# Altium schematic sheet 11_LMS1_Power.SchDoc: LMS7002M power supply (LMS1)
size A3; Organization: Lime Microsystems; Address1: Surrey Tech Centre; Address2: Guildford GU2 7YG; Address3: Surrey; Address4: United Kingdom; Revision: v1.1; SheetNumber: 10; SheetTotal: 31
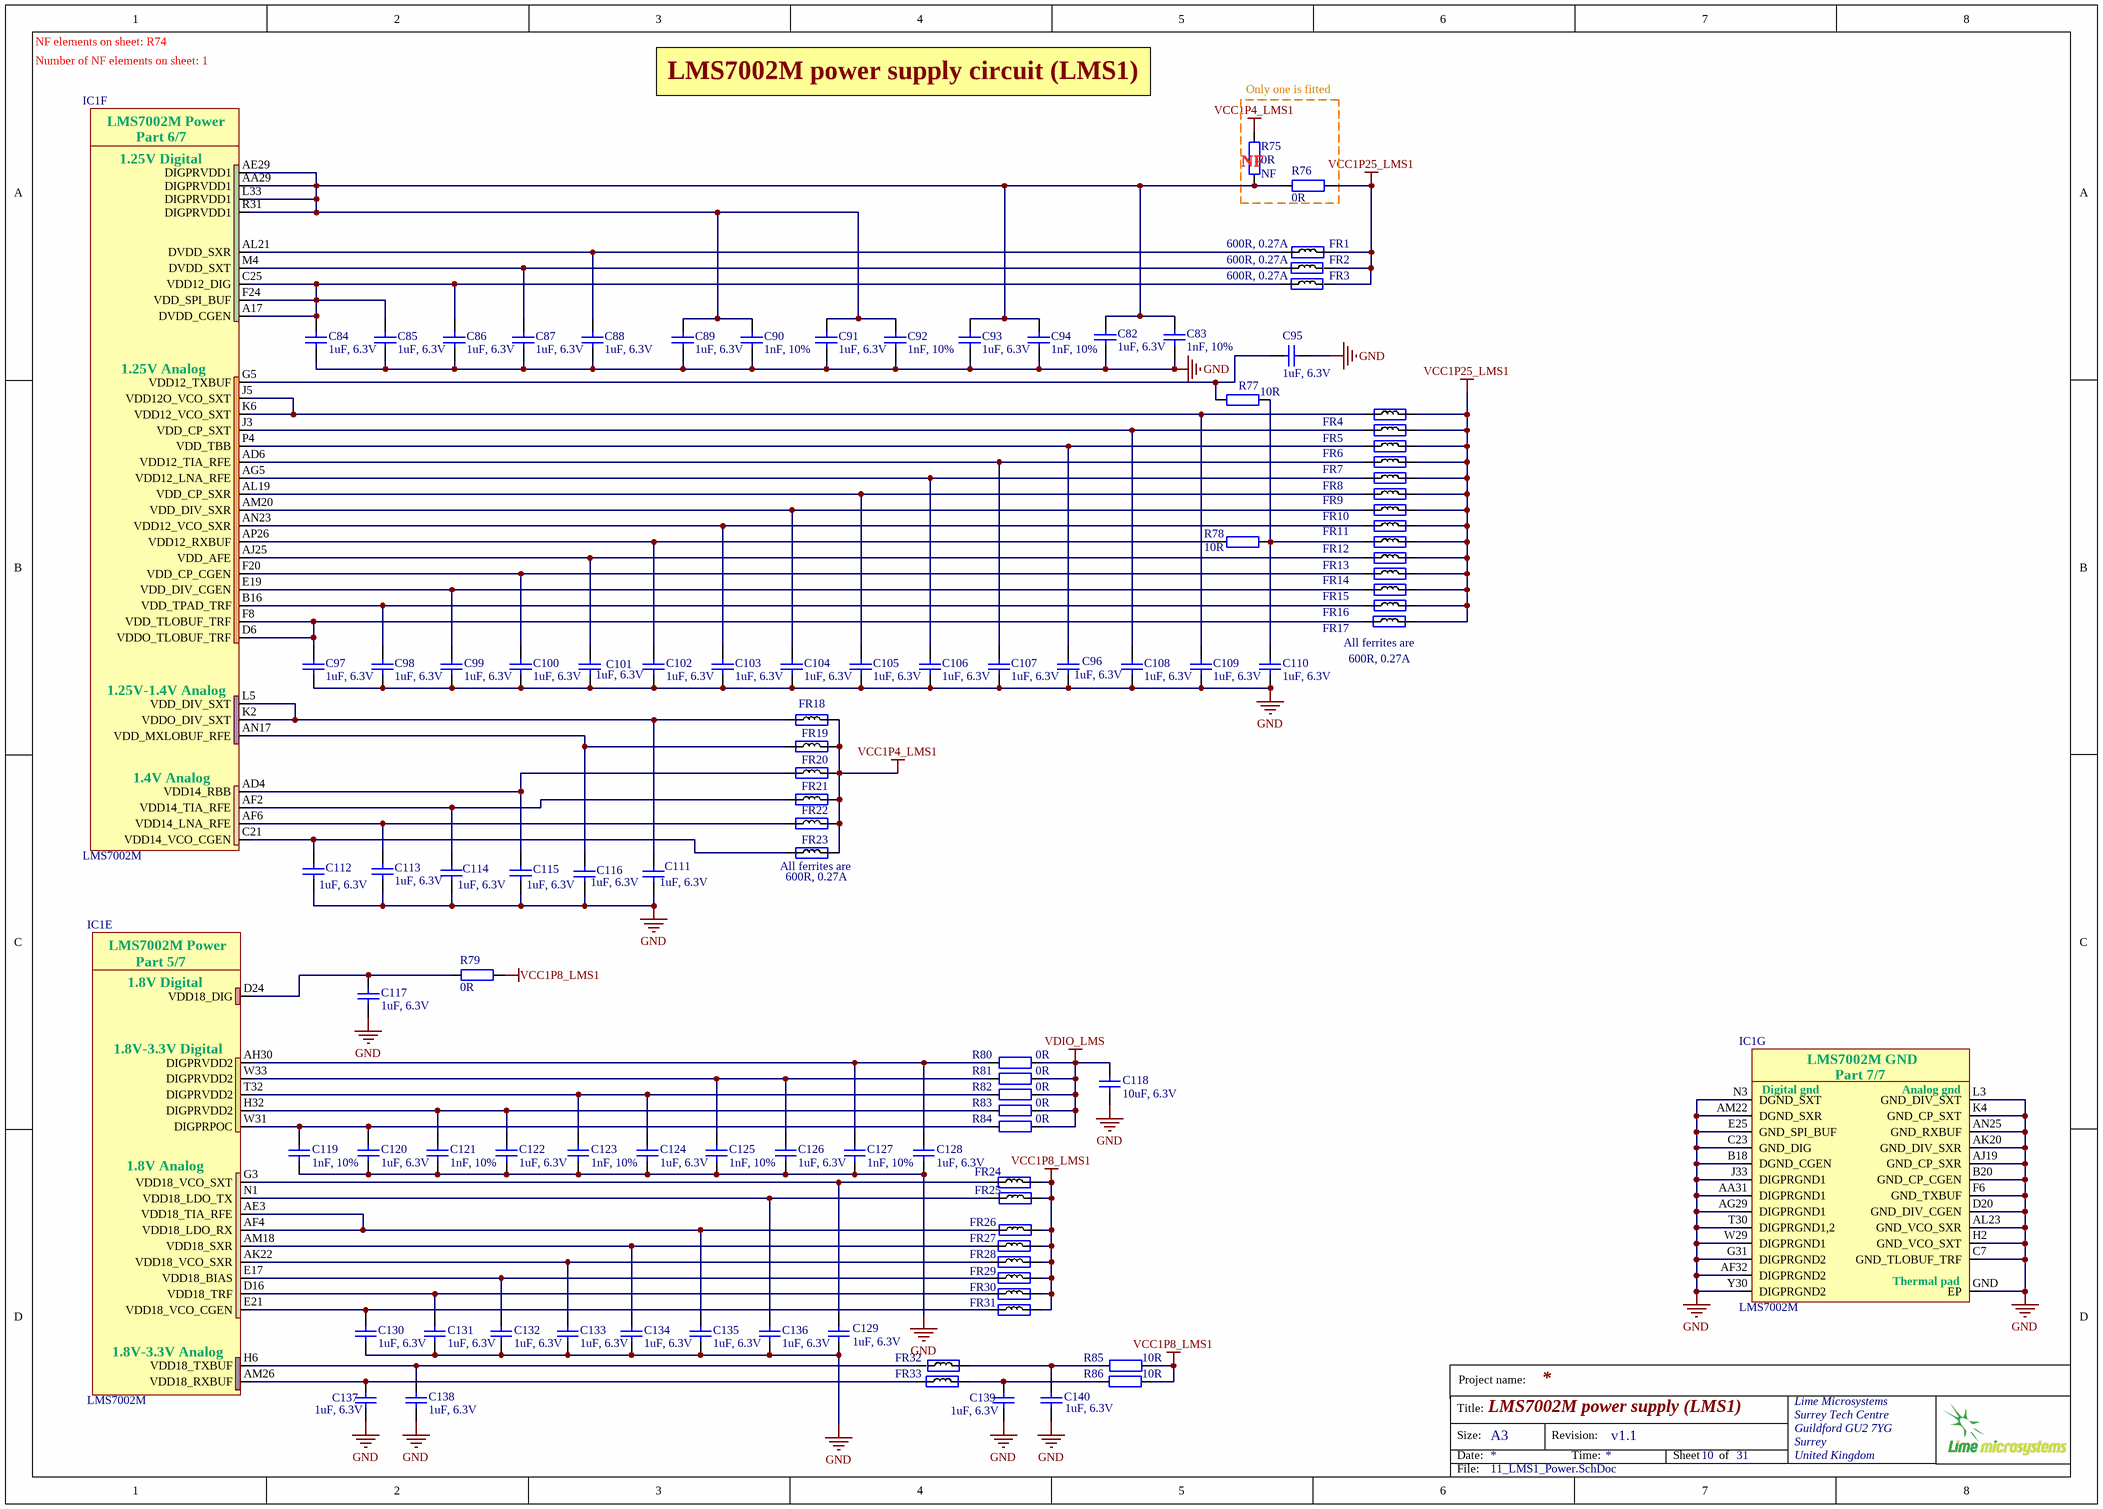
[diagram p0: 11_LMS1_Power.SchDoc]

## Parts
C82  1uF, 6.3V  [CAP0201]
C83  1nF, 10%  [CAP0201]
C84  1uF, 6.3V  [CAP0201]
C85  1uF, 6.3V  [CAP0201]
C86  1uF, 6.3V  [CAP0201]
C87  1uF, 6.3V  [CAP0201]
C88  1uF, 6.3V  [CAP0201]
C89  1uF, 6.3V  [CAP0201]
C90  1nF, 10%  [CAP0201]
C91  1uF, 6.3V  [CAP0201]
C92  1nF, 10%  [CAP0201]
C93  1uF, 6.3V  [CAP0201]
C94  1nF, 10%  [CAP0201]
C95  1uF, 6.3V  [CAP0201]
C96  1uF, 6.3V  [CAP0201]
C97  1uF, 6.3V  [CAP0201]
C98  1uF, 6.3V  [CAP0201]
C99  1uF, 6.3V  [CAP0201]
C100  1uF, 6.3V  [CAP0201]
C101  1uF, 6.3V  [CAP0201]
C102  1uF, 6.3V  [CAP0201]
C103  1uF, 6.3V  [CAP0201]
C104  1uF, 6.3V  [CAP0201]
C105  1uF, 6.3V  [CAP0201]
C106  1uF, 6.3V  [CAP0201]
C107  1uF, 6.3V  [CAP0201]
C108  1uF, 6.3V  [CAP0201]
C109  1uF, 6.3V  [CAP0201]
C110  1uF, 6.3V  [CAP0201]
C111  1uF, 6.3V  [CAP0201]
C112  1uF, 6.3V  [CAP0201]
C113  1uF, 6.3V  [CAP0201]
C114  1uF, 6.3V  [CAP0201]
C115  1uF, 6.3V  [CAP0201]
C116  1uF, 6.3V  [CAP0201]
C117  1uF, 6.3V  [CAP0201]
C118  10uF, 6.3V  [CAP0603]
C119  1nF, 10%  [CAP0201]
C120  1uF, 6.3V  [CAP0201]
C121  1nF, 10%  [CAP0201]
C122  1uF, 6.3V  [CAP0201]
C123  1nF, 10%  [CAP0201]
C124  1uF, 6.3V  [CAP0201]
C125  1nF, 10%  [CAP0201]
C126  1uF, 6.3V  [CAP0201]
C127  1nF, 10%  [CAP0201]
C128  1uF, 6.3V  [CAP0201]
C129  1uF, 6.3V  [CAP0201]
C130  1uF, 6.3V  [CAP0201]
C131  1uF, 6.3V  [CAP0201]
C132  1uF, 6.3V  [CAP0201]
C133  1uF, 6.3V  [CAP0201]
C134  1uF, 6.3V  [CAP0201]
C135  1uF, 6.3V  [CAP0201]
C136  1uF, 6.3V  [CAP0201]
C137  1uF, 6.3V  [CAP0201]
C138  1uF, 6.3V  [CAP0201]
C139  1uF, 6.3V  [CAP0201]
C140  1uF, 6.3V  [CAP0201]
FR1  600R, 0.27A  [RES0201]
FR2  600R, 0.27A  [RES0201]
FR3  600R, 0.27A  [RES0201]
FR4  600R, 0.27A  [RES0201]  (value not drawn)
FR5  600R, 0.27A  [RES0201]  (value not drawn)
FR6  600R, 0.27A  [RES0201]  (value not drawn)
FR7  600R, 0.27A  [RES0201]  (value not drawn)
FR8  600R, 0.27A  [RES0201]  (value not drawn)
FR9  600R, 0.27A  [RES0201]  (value not drawn)
FR10  600R, 0.27A  [RES0201]  (value not drawn)
FR11  600R, 0.27A  [RES0201]  (value not drawn)
FR12  600R, 0.27A  [RES0201]  (value not drawn)
FR13  600R, 0.27A  [RES0201]  (value not drawn)
FR14  600R, 0.27A  [RES0201]  (value not drawn)
FR15  600R, 0.27A  [RES0201]  (value not drawn)
FR16  600R, 0.27A  [RES0201]  (value not drawn)
FR17  600R, 0.27A  [RES0201]  (value not drawn)
FR18  600R, 0.27A  [RES0201]  (value not drawn)
FR19  600R, 0.27A  [RES0201]  (value not drawn)
FR20  600R, 0.27A  [RES0201]  (value not drawn)
FR21  600R, 0.27A  [RES0201]  (value not drawn)
FR22  600R, 0.27A  [RES0201]  (value not drawn)
FR23  600R, 0.27A  [RES0201]  (value not drawn)
FR24  600R, 0.27A  [RES0201]  (value not drawn)
FR25  600R, 0.27A  [RES0201]  (value not drawn)
FR26  600R, 0.27A  [RES0201]  (value not drawn)
FR27  600R, 0.27A  [RES0201]  (value not drawn)
FR28  600R, 0.27A  [RES0201]  (value not drawn)
FR29  600R, 0.27A  [RES0201]  (value not drawn)
FR30  600R, 0.27A  [RES0201]  (value not drawn)
FR31  600R, 0.27A  [RES0201]  (value not drawn)
FR32  600R, 0.27A  [RES0201]  (value not drawn)
FR33  600R, 0.27A  [RES0201]  (value not drawn)
IC1  LMS7002M  [LMS7002M_v5]  (parts E,F,G of 7)
R75  0R  Assembly Info: NF  [RES0402]
R76  0R  [RES0402]
R77  10R  [RES0201]
R78  10R  [RES0201]
R79  0R  [RES0201]
R80  0R  [RES0402]
R81  0R  [RES0402]
R82  0R  [RES0402]
R83  0R  [RES0402]
R84  0R  [RES0402]
R85  10R  [RES0201]
R86  10R  [RES0201]

## Blocks framed on the sheet
Only one is fitted: R75 R76

## Nets
GND: C82.2 C83.2 C84.2 C85.2 C86.2 C87.1 C88.2 C89.2 C90.2 C91.2 C92.2 C93.2 C94.2 C95.2 C96.2 C97.2 C98.2 C99.2 C100.1 C101.2 C102.2 C103.2 C104.2 C105.2 C106.2 C107.1 C108.2 C109.1 C110.1 C111.2 C112.2 C113.2 C114.2 C115.2 C116.2 C117.2 C118.1 C119.2 C120.2 C121.2 C122.2 C123.2 C124.2 C125.2 C126.2 C127.2 C128.2 C129.2 C130.2 C131.2 C132.2 C133.2 C134.2 C135.2 C136.2 C137.2 C138.2 C139.2 C140.2 IC1.AA31(DIGPRGND1) IC1.AF32(DIGPRGND2) IC1.AG29(DIGPRGND1) IC1.AJ19(GND_CP_SXR) IC1.AK20(GND_DIV_SXR) IC1.AL23(GND_VCO_SXR) IC1.AM22(DGND_SXR) IC1.AN25(GND_RXBUF) IC1.B18(DGND_CGEN) IC1.B20(GND_CP_CGEN) IC1.C7(GND_TLOBUF_TRF) IC1.C23(GND_DIG) IC1.D20(GND_DIV_CGEN) IC1.E25(GND_SPI_BUF) IC1.F6(GND_TXBUF) IC1.G31(DIGPRGND2) IC1.GND(EP) IC1.H2(GND_VCO_SXT) IC1.J33(DIGPRGND1) IC1.K4(GND_CP_SXT) IC1.L3(GND_DIV_SXT) IC1.N3(DGND_SXT) IC1.T30(DIGPRGND1,2) IC1.W29(DIGPRGND1) IC1.Y30(DIGPRGND2)
VCC1P4_LMS1: FR18.2 FR19.2 FR20.2 FR21.2 FR22.2 FR23.2 R75.1
VCC1P8_LMS1: FR24.2 FR25.1 FR26.1 FR27.2 FR28.2 FR29.2 FR30.2 FR31.2 R79.2 R85.2 R86.1
VCC1P25_LMS1: FR1.2 FR2.2 FR3.2 FR4.2 FR5.2 FR6.2 FR7.2 FR8.2 FR9.2 FR10.2 FR11.2 FR12.2 FR13.2 FR14.2 FR15.2 FR16.2 FR17.2 R76.1
VDIO_LMS: C118.2 R80.1 R81.1 R82.1 R83.1 R84.1
NetC82_1: C82.1 C83.1 C89.1 C90.1 C91.1 C92.1 C93.1 C94.1 IC1.AA29(DIGPRVDD1) IC1.AE29(DIGPRVDD1) IC1.L33(DIGPRVDD1) IC1.R31(DIGPRVDD1) R75.2 R76.2
NetC84_1: C84.1 C85.1 C86.1 FR3.1 IC1.A17(DVDD_CGEN) IC1.C25(VDD12_DIG) IC1.F24(VDD_SPI_BUF)
NetC87_2: C87.2 FR2.1 IC1.M4(DVDD_SXT)
NetC88_1: C88.1 FR1.1 IC1.AL21(DVDD_SXR)
NetC95_1: C95.1 IC1.G5(VDD12_TXBUF) R77.1
NetC96_1: C96.1 FR6.1 IC1.P4(VDD_TBB)
NetC97_1: C97.1 FR17.1 IC1.D6(VDDO_TLOBUF_TRF) IC1.F8(VDD_TLOBUF_TRF)
NetC98_1: C98.1 FR16.1 IC1.B16(VDD_TPAD_TRF)
NetC99_1: C99.1 FR15.1 IC1.E19(VDD_DIV_CGEN)
NetC100_2: C100.2 FR14.1 IC1.F20(VDD_CP_CGEN)
NetC101_1: C101.1 FR13.1 IC1.AJ25(VDD_AFE)
NetC102_1: C102.1 IC1.AP26(VDD12_RXBUF) R78.1
NetC103_1: C103.1 FR11.1 IC1.AN23(VDD12_VCO_SXR)
NetC104_1: C104.1 FR10.1 IC1.AM20(VDD_DIV_SXR)
NetC105_1: C105.1 FR9.1 IC1.AL19(VDD_CP_SXR)
NetC106_1: C106.1 FR8.1 IC1.AG5(VDD12_LNA_RFE)
NetC107_2: C107.2 FR7.1 IC1.AD6(VDD12_TIA_RFE)
NetC108_1: C108.1 FR5.1 IC1.J3(VDD_CP_SXT)
NetC109_2: C109.2 FR4.1 IC1.J5(VDD12O_VCO_SXT) IC1.K6(VDD12_VCO_SXT)
NetC110_2: C110.2 FR12.1 R77.2 R78.2
NetC111_1: C111.1 FR18.1 IC1.K2(VDDO_DIV_SXT) IC1.L5(VDD_DIV_SXT)
NetC112_1: C112.1 FR23.1 IC1.C21(VDD14_VCO_CGEN)
NetC113_1: C113.1 FR22.1 IC1.AF6(VDD14_LNA_RFE)
NetC114_1: C114.1 FR21.1 IC1.AF2(VDD14_TIA_RFE)
NetC115_1: C115.1 FR20.1 IC1.AD4(VDD14_RBB)
NetC116_1: C116.1 FR19.1 IC1.AN17(VDD_MXLOBUF_RFE)
NetC117_1: C117.1 IC1.D24(VDD18_DIG) R79.1
NetC119_1: C119.1 C120.1 IC1.W31(DIGPRPOC) R84.2
NetC121_1: C121.1 C122.1 IC1.H32(DIGPRVDD2) R83.2
NetC123_1: C123.1 C124.1 IC1.T32(DIGPRVDD2) R82.2
NetC125_1: C125.1 C126.1 IC1.W33(DIGPRVDD2) R81.2
NetC127_1: C127.1 C128.1 IC1.AH30(DIGPRVDD2) R80.2
NetC129_1: C129.1 FR24.1 IC1.G3(VDD18_VCO_SXT)
NetC130_1: C130.1 FR31.1 IC1.E21(VDD18_VCO_CGEN)
NetC131_1: C131.1 FR30.1 IC1.D16(VDD18_TRF)
NetC132_1: C132.1 FR29.1 IC1.E17(VDD18_BIAS)
NetC133_1: C133.1 FR28.1 IC1.AK22(VDD18_VCO_SXR)
NetC134_1: C134.1 FR27.1 IC1.AM18(VDD18_SXR)
NetC135_1: C135.1 FR26.2 IC1.AE3(VDD18_TIA_RFE) IC1.AF4(VDD18_LDO_RX)
NetC136_1: C136.1 FR25.2 IC1.N1(VDD18_LDO_TX)
NetC137_1: C137.1 FR33.1 IC1.AM26(VDD18_RXBUF)
NetC138_1: C138.1 FR32.2 IC1.H6(VDD18_TXBUF)
NetC139_1: C139.1 FR33.2 R86.2
NetC140_1: C140.1 FR32.1 R85.1

## Notes on the sheet
- NF elements on sheet: R74
- Number of NF elements on sheet: 1
- LMS7002M power supply circuit (LMS1)
- (near R75) NF
- (near FR17) All ferrites are
- 600R, 0.27A
- (near FR23) All ferrites are
- (near FR23) 600R, 0.27A
- Project name:
- Title:
- Size:
- Date:
- A3
- Revision:
- Time:
- Sheet
- of
- File:
- (in symbol LMS7002Mr4, part E) LMS7002M Power; Part 5/7; 1.8V Digital; 1.8V-3.3V Digital; 1.8V Analog; 1.8V-3.3V Analog
- (in symbol LMS7002Mr4, part F) LMS7002M Power; Part 6/7; 1.25V Digital; 1.25V Analog; 1.25V-1.4V Analog; 1.4V Analog
- (in symbol LMS7002Mr4, part G) LMS7002M GND; Part 7/7; Digital gnd; Analog gnd; Thermal pad

## Library data of the parts
C82 C84-C89 C91 C93 C95-C117 C120 C122 C124 C126 C128-C140 = Cap_0402: Manufacturer: TDK Corporation; Manufacturer Part Number 1: JMK063ABJ105MP-F; Part Description: 1µF ±20% 6.3V X5R Ceramic Capacitor -55°C ~ 85°C Surface Mount, MLCC 0201 (0603 Metric) 0.024" L x 0.012" W (0.60mm x 0.30mm); Value: 1uF, 20%; Tolerance: ±20%; Capacitance: 1.0µF; Temperature Coefficient: X5R; Supplier 1: Digi-Key; Supplier Part Number 1: 587-5864-2-ND; Applications: General Purpose; Features: -; Lead Style: -; Ratings: -; Thickness (Max): -; Lead Spacing: -; Height - Seated (Max): -; Size / Dimension: 0.024" L x 0.012" W (0.60mm x 0.30mm); Mounting Type: Surface Mount, MLCC; Operating Temperature: -55°C ~ 85°C; Package / Case: 0201 (0603 Metric); Packaging: Cut Tape (CT); Voltage - Rated: 6.3V; Category: Capacitors; RoHS: RoHS Compliant
C83 C90 C92 C94 C119 C121 C123 C125 C127 = Cap_0402: Manufacturer Part Number 1: C0603X7R1E102K030BA; Manufacturer: TDK Corporation; Part Description: 1000pF ±10% 25V X7R Ceramic Capacitor -55°C ~ 125°C Surface Mount, MLCC 0201 (0603 Metric) 0.024" L x 0.012" W (0.60mm x 0.30mm); Voltage - Rated: 25V; Temperature Coefficient: X7R; Capacitance: 1000pF; Value: 1nF, 10%; Supplier 1: Digi-Key; Supplier Part Number 1: 445-7275-1-ND; Features: -; Package / Case: 0201 (0603 Metric); Lead Spacing: -; Mounting Type: Surface Mount, MLCC; Lead Style: -; Height - Seated (Max): -; Operating Temperature: -55°C ~ 125°C; Tolerance: ±10%; Size / Dimension: 0.024" L x 0.012" W (0.60mm x 0.30mm); Applications: General Purpose; Ratings: -; Thickness (Max): 0.013" (0.33mm); RoHS: RoHS Compliant; Packaging: Cut Tape (CT); Category: Capacitors
C118 = Cap_0603: Manufacturer Part Number 1: CC0603MRX5R5BB106; Manufacturer: Yageo; Part Description: 10µF ±20% 6.3V X5R Ceramic Capacitor -55°C ~ 85°C Surface Mount, MLCC 0603 (1608 Metric) 0.063" L x 0.031" W (1.60mm x 0.80mm); Capacitance: 10µF; Tolerance: ±20%; Supplier 1: Digi-Key; Supplier Part Number 1: 311-1448-2-ND; Package / Case: 0603 (1608 Metric); Category: Capacitors; Voltage - Rated: 6.3V; Value: 10uF, 6.3V
FR1-FR33 = Ferrite: Manufacturer Part Number 1: BK0603TS601-T; Manufacturer: Taiyo Yuden; Part Description: FERRITE BEAD 600 OHM 0201 1LN; DC Resistance (DCR): 750 mOhm Max; Filter Type: Differential Mode - Single; Impedance @ Frequency: 600 Ohm @ 100MHz; Current Rating: 270mA; Value: 600R@100MHz; Supplier 1: Digi-Key; Supplier Part Number 1: 587-3277-1-ND; Size / Dimension: 0.024" L x 0.012" W (0.60mm x 0.30mm); Package / Case: 0201 (0603 Metric); Height (Max): 0.013" (0.33mm); Mounting Type: Surface Mount; Packaging: Cut Tape (CT); RoHS: RoHS Compliant; Category: Filters
IC1 = LMS7002Mr4: Schematic symbol revision 4. Default footprint - 0.31mm pad; Manufacturer: Lime Microsystems; Part Description: IC FPRF Transceiver LMS7002M; 261 pin aQFN; Supplier 1: Lime Microsystems; Supplier Part Number 1: LMS7002M; Manufacturer Part Number 1: LMS7002M
R75 R76 R80-R84 = Res_0402: Manufacturer Part Number 1: RC0402JR-070RL; Manufacturer: Yageo; Part Description: RES SMD 0.0OHM JUMPER 1/16W 0402; Resistance (Ohms): 0.0; Tolerance: Jumper; Power (Watts): 0.063W, 1/16W; Value: 0R; Supplier 1: Digi-Key; Supplier Part Number 1: 311-0.0JRTR-ND; Category: Resistors; Temperature Coefficient: -; Features: Moisture Resistant; Supplier Device Package: 0402; Height: 0.016" (0.40mm); Package / Case: 0402 (1005 Metric); Operating Temperature: -55°C ~ 155°C; Size / Dimension: 0.039" L x 0.020" W (1.00mm x 0.50mm); Composition: Thick Film; Packaging: Tape & Reel (TR); Number of Terminations: 2; RoHS: RoHS Compliant
R77 R78 R85 R86 = Res_0402: Manufacturer: Panasonic Electronic Components; Part Description: RES SMD 10 OHM 1% 1/20W 0201; Manufacturer Part Number 1: ERJ-1GEF10R0C; Power (Watts): 0.05W, 1/20W; Resistance (Ohms): 10; Tolerance: ±1%; Temperature Coefficient: ±200ppm/°C; Value: 10R; Supplier 1: Digi-Key; Supplier Part Number 1: P10.0ABCT-ND; Package / Case: 0201 (0603 Metric); Height: 0.010" (0.26mm); Supplier Device Package: 0201; Packaging: Cut Tape (CT); Composition: Thick Film; Category: Resistors; Number of Terminations: 2; Size / Dimension: 0.024" L x 0.012" W (0.60mm x 0.30mm); Operating Temperature: -55°C ~ 125°C; Features: -; RoHS: RoHS Compliant
R79 = Res_0402: Manufacturer Part Number 1: RC0201FR-070RL; Manufacturer: Rohm Semiconductor; Part Description: RES SMD 0.0OHM JUMPER 1/20W 0201; Resistance (Ohms): 0.0; Power (Watts): 0.05W, 1/20W; Tolerance: Jumper; Value: 0R; Supplier 1: Digi-Key; Supplier Part Number 1: 311-0.0MCT-ND; Number of Terminations: 2; Operating Temperature: -55°C ~ 125°C; Package / Case: 0201 (0603 Metric); Height: 0.010" (0.26mm); Supplier Device Package: 0201 (0603 Metric); Size / Dimension: 0.024" L x 0.012" W (0.60mm x 0.30mm); Temperature Coefficient: -; Category: Resistors; Features: -; RoHS: RoHS Compliant; Composition: Thick Film; Packaging: Cut Tape (CT)